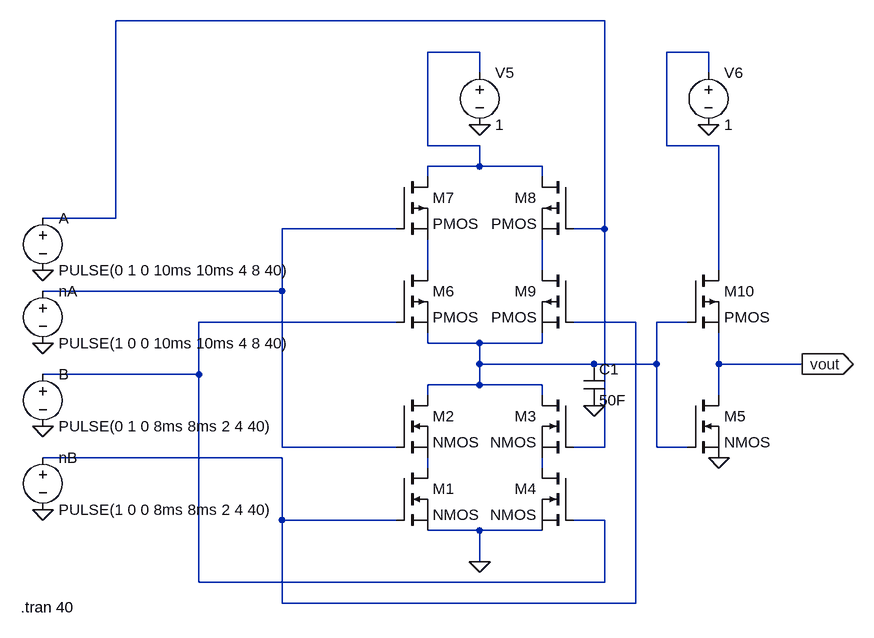
[diagram p0: schematic xor_gate.asc]
xor_gate.asc, the LTspice schematic file:
Version 4
SHEET 1 880 680
WIRE 448 -448 -304 -448
WIRE 256 -400 176 -400
WIRE 608 -400 544 -400
WIRE 256 -368 256 -400
WIRE 608 -368 608 -400
WIRE 176 -256 176 -400
WIRE 256 -256 176 -256
WIRE 544 -256 544 -400
WIRE 624 -256 544 -256
WIRE 256 -224 256 -256
WIRE 256 -224 176 -224
WIRE 352 -224 256 -224
WIRE 176 -208 176 -224
WIRE 352 -208 352 -224
WIRE -304 -144 -304 -448
WIRE -304 -144 -416 -144
WIRE 128 -128 -48 -128
WIRE 448 -128 448 -448
WIRE 448 -128 400 -128
WIRE 176 -64 176 -112
WIRE 352 -64 352 -112
WIRE 624 -64 624 -256
WIRE -48 -32 -48 -128
WIRE -48 -32 -416 -32
WIRE 128 16 -176 16
WIRE 496 16 400 16
WIRE 576 16 528 16
WIRE 176 48 176 32
WIRE 256 48 176 48
WIRE 352 48 352 32
WIRE 352 48 256 48
WIRE 256 80 256 48
WIRE 432 80 256 80
WIRE 528 80 528 16
WIRE 528 80 432 80
WIRE 624 80 624 32
WIRE 752 80 624 80
WIRE -176 96 -176 16
WIRE -176 96 -416 96
WIRE 256 112 256 80
WIRE 256 112 176 112
WIRE 352 112 256 112
WIRE 176 128 176 112
WIRE 352 128 352 112
WIRE 624 128 624 80
WIRE -48 208 -48 -32
WIRE 128 208 -48 208
WIRE 448 208 448 -128
WIRE 448 208 400 208
WIRE 528 208 528 80
WIRE 576 208 528 208
WIRE -48 224 -416 224
WIRE 176 240 176 224
WIRE 352 240 352 224
WIRE -48 320 -48 224
WIRE 128 320 -48 320
WIRE 448 320 400 320
WIRE 256 336 176 336
WIRE 352 336 256 336
WIRE 256 384 256 336
WIRE -176 416 -176 96
WIRE 448 416 448 320
WIRE 448 416 -176 416
WIRE -48 448 -48 320
WIRE 496 448 496 16
WIRE 496 448 -48 448
FLAG -416 -64 0
FLAG -416 48 0
FLAG -416 304 0
FLAG -416 176 0
FLAG 256 384 0
FLAG 624 224 0
FLAG 608 -288 0
FLAG 256 -288 0
FLAG 752 80 vout
IOPIN 752 80 Out
FLAG 432 144 0
SYMBOL nmos 128 240 R0
SYMATTR InstName M1
SYMBOL nmos 128 128 R0
SYMATTR InstName M2
SYMBOL nmos 400 128 M0
SYMATTR InstName M3
SYMBOL nmos 400 240 M0
SYMATTR InstName M4
SYMBOL nmos 576 128 R0
SYMATTR InstName M5
SYMBOL pmos 128 -64 R0
SYMATTR InstName M6
SYMBOL pmos 128 -208 R0
SYMATTR InstName M7
SYMBOL pmos 400 -208 M0
SYMATTR InstName M8
SYMBOL pmos 400 -64 M0
SYMATTR InstName M9
SYMBOL pmos 576 -64 R0
SYMATTR InstName M10
SYMBOL voltage -416 -160 R0
WINDOW 123 0 0 Left 2
WINDOW 39 0 0 Left 2
SYMATTR InstName A
SYMATTR Value PULSE(0 1 0 10ms 10ms 4 8 40)
SYMBOL voltage -416 -48 R0
WINDOW 123 0 0 Left 2
WINDOW 39 0 0 Left 2
SYMATTR InstName nA
SYMATTR Value PULSE(1 0 0 10ms 10ms 4 8 40)
SYMBOL voltage -416 80 R0
WINDOW 123 0 0 Left 2
WINDOW 39 0 0 Left 2
SYMATTR InstName B
SYMATTR Value PULSE(0 1 0 8ms 8ms 2 4 40)
SYMBOL voltage -416 208 R0
WINDOW 123 0 0 Left 2
WINDOW 39 0 0 Left 2
SYMATTR InstName nB
SYMATTR Value PULSE(1 0 0 8ms 8ms 2 4 40)
SYMBOL voltage 256 -384 R0
WINDOW 123 0 0 Left 2
WINDOW 39 0 0 Left 2
SYMATTR InstName V5
SYMATTR Value 1
SYMBOL voltage 608 -384 R0
WINDOW 123 0 0 Left 2
WINDOW 39 0 0 Left 2
SYMATTR InstName V6
SYMATTR Value 1
SYMBOL cap 416 80 R0
SYMATTR InstName C1
SYMATTR Value 50F
TEXT -450 454 Left 2 !.tran 40

The netlist it stands for:
* xor_gate.asc
M1 N010 N008 0 0 NMOS
M2 N009 N004 N010 N010 NMOS
M3 N009 N001 N011 N011 NMOS
M4 N011 N007 0 0 NMOS
M5 vout N009 0 0 NMOS
M6 N005 N007 N009 N009 PMOS
M7 N002 N004 N005 N005 PMOS
M8 N002 N001 N006 N006 PMOS
M9 N006 N008 N009 N009 PMOS
M10 N003 N009 vout vout PMOS
V§A N001 0 PULSE(0 1 0 10ms 10ms 4 8 40)
V§nA N004 0 PULSE(1 0 0 10ms 10ms 4 8 40)
V§B N007 0 PULSE(0 1 0 8ms 8ms 2 4 40)
V§nB N008 0 PULSE(1 0 0 8ms 8ms 2 4 40)
V5 N002 0 1
V6 N003 0 1
C1 N009 0 50F
.model NMOS NMOS
.model PMOS PMOS
.lib standard.mos
.tran 40
.backanno
.end